# Altium schematic sheet S bus (5.775 X 3.30 inches).schdoc: Módulo do processamento do Kit didático
size A4; Organization: PEA USP; Address1: Address1; Address2: Address2; Address3: Address3; Address4: Address4; DocumentNumber: 1; Revision: LMK, HMH; SheetNumber: 1; SheetTotal: 1; Author: Gustavo Soares Valentim; ProjectName: Módulo do processamento
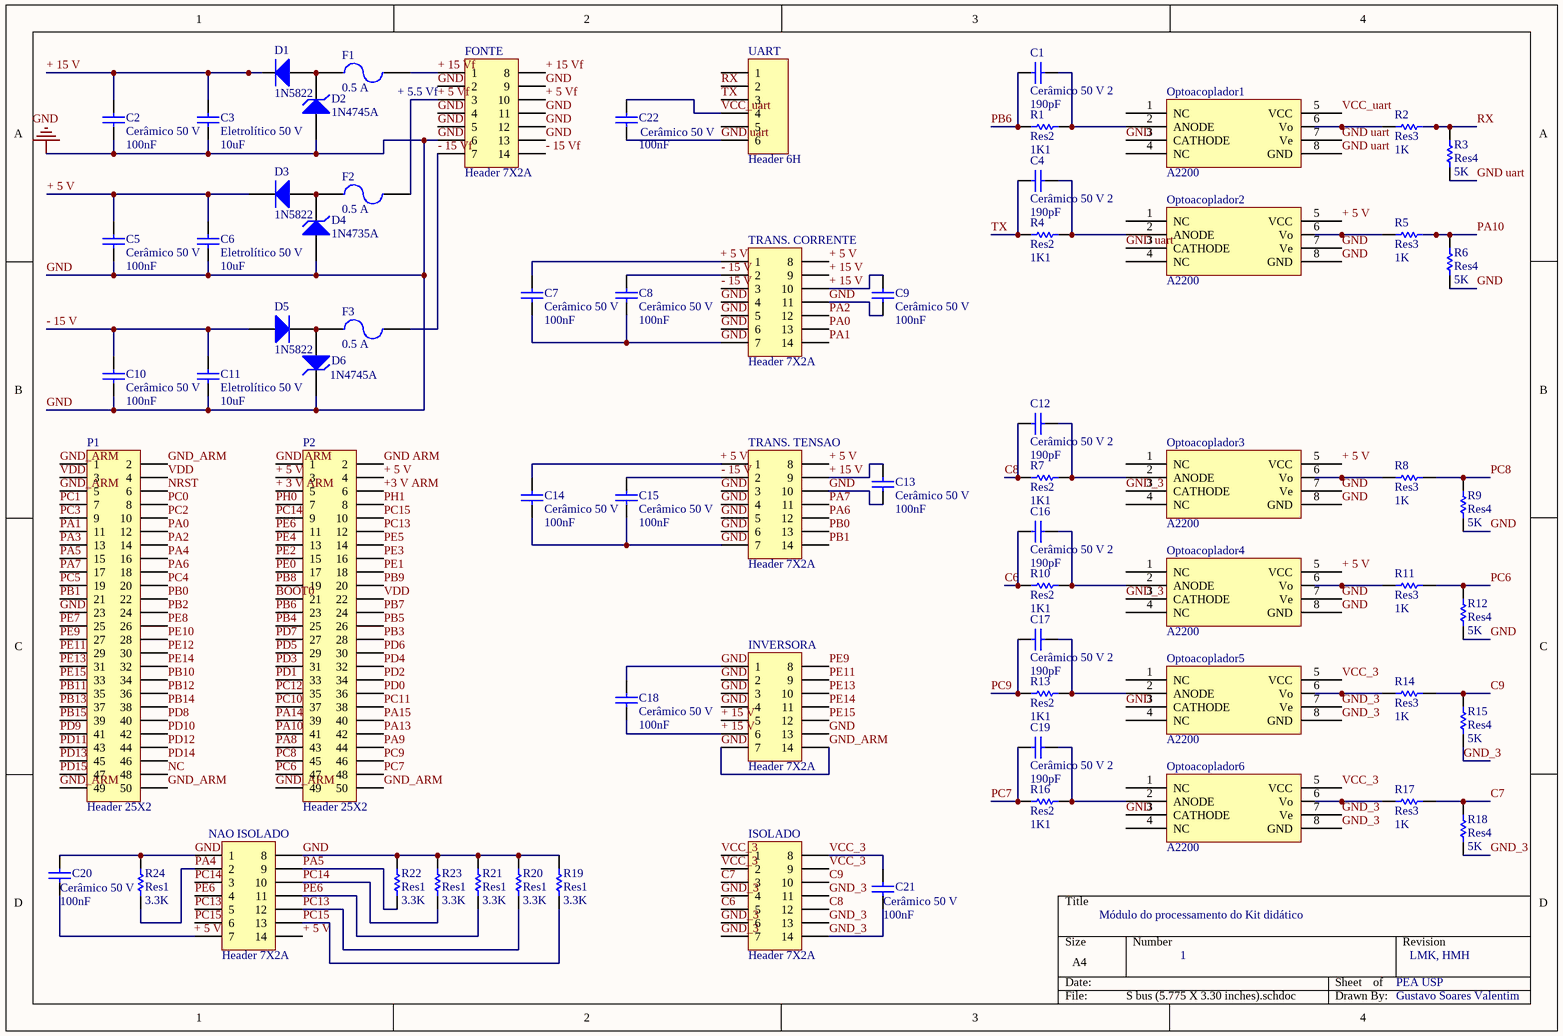
[diagram p0: S bus (5.775 X 3.30 inches).schdoc]

## Parts
C1  Cerâmico 50 V 2  value 190pF  [RAD-0.2]
C2  Cerâmico 50 V  value 100nF  [RAD-0.2]
C3  Eletrolítico 50 V  value 10uF  [RB5-10.5]
C4  Cerâmico 50 V 2  value 190pF  [RAD-0.2]
C5  Cerâmico 50 V  value 100nF  [RAD-0.2]
C6  Eletrolítico 50 V  value 10uF  [RB5-10.5]
C7  Cerâmico 50 V  value 100nF  [RAD-0.2]
C8  Cerâmico 50 V  value 100nF  [RAD-0.2]
C9  Cerâmico 50 V  value 100nF  [RAD-0.2]
C10  Cerâmico 50 V  value 100nF  [RAD-0.2]
C11  Eletrolítico 50 V  value 10uF  [RB5-10.5]
C12  Cerâmico 50 V 2  value 190pF  [RAD-0.2]
C13  Cerâmico 50 V  value 100nF  [RAD-0.2]
C14  Cerâmico 50 V  value 100nF  [RAD-0.2]
C15  Cerâmico 50 V  value 100nF  [RAD-0.2]
C16  Cerâmico 50 V 2  value 190pF  [RAD-0.2]
C17  Cerâmico 50 V 2  value 190pF  [RAD-0.2]
C18  Cerâmico 50 V  value 100nF  [RAD-0.2]
C19  Cerâmico 50 V 2  value 190pF  [RAD-0.2]
C20  Cerâmico 50 V  value 100nF  [RAD-0.2]
C21  Cerâmico 50 V  value 100nF  [RAD-0.2]
C22  Cerâmico 50 V  value 100nF  [RAD-0.2]
D1  1N5822  [AXIAL-0.4]
D2  1N4745A  [DIODE-0.4]
D3  1N5822  [AXIAL-0.4]
D4  1N4735A  [DIODE-0.4]
D5  1N5822  [AXIAL-0.4]
D6  1N4745A  [DIODE-0.4]
F1  0.5 A  [Fusivel]
F2  0.5 A  [Fusivel]
F3  0.5 A  [Fusivel]
FONTE  Header 7X2A  [HDR2X7_CEN]
INVERSORA  Header 7X2A  [HDR2X7_CEN]
ISOLADO  Header 7X2A  [HDR2X7_CEN]
NAO_ISOLADO  Header 7X2A  [HDR2X7_CEN]
Optoacoplador1  A2200  [DIP8]
Optoacoplador2  A2200  [DIP8]
Optoacoplador3  A2200  [DIP8]
Optoacoplador4  A2200  [DIP8]
Optoacoplador5  A2200  [DIP8]
Optoacoplador6  A2200  [DIP8]
P1  Header 25X2  [HDR2X25]
P2  Header 25X2  [HDR2X25]
R1  Res2  value 1K1  [AXIAL-0.3]
R2  Res3  value 1K  [AXIAL-0.3]
R3  Res4  value 5K  [AXIAL-0.3]
R4  Res2  value 1K1  [AXIAL-0.3]
R5  Res3  value 1K  [AXIAL-0.3]
R6  Res4  value 5K  [AXIAL-0.3]
R7  Res2  value 1K1  [AXIAL-0.3]
R8  Res3  value 1K  [AXIAL-0.3]
R9  Res4  value 5K  [AXIAL-0.3]
R10  Res2  value 1K1  [AXIAL-0.3]
R11  Res3  value 1K  [AXIAL-0.3]
R12  Res4  value 5K  [AXIAL-0.3]
R13  Res2  value 1K1  [AXIAL-0.3]
R14  Res3  value 1K  [AXIAL-0.3]
R15  Res4  value 5K  [AXIAL-0.3]
R16  Res2  value 1K1  [AXIAL-0.3]
R17  Res3  value 1K  [AXIAL-0.3]
R18  Res4  value 5K  [AXIAL-0.3]
R19  Res1  value 3.3K  [AXIAL-0.3]
R20  Res1  value 3.3K  [AXIAL-0.3]
R21  Res1  value 3.3K  [AXIAL-0.3]
R22  Res1  value 3.3K  [AXIAL-0.3]
R23  Res1  value 3.3K  [AXIAL-0.3]
R24  Res1  value 3.3K  [AXIAL-0.3]
TRANS._CORRENTE  Header 7X2A  [HDR2X7_CEN]
TRANS._TENSAO  Header 7X2A  [HDR2X7_CEN]
UART  Header 6H  [HDR1X6]

## Nets
GND: C2.1 C3.1 C5.1 C6.1 C7.1 C8.1 C9.1 C10.1 C11.1 C13.1 C14.1 C15.1 C18.2 C20.2 D2.1(A) D4.1(A) D6.2(K) FONTE.2 FONTE.4 FONTE.5 FONTE.6 FONTE.9 FONTE.11 FONTE.12 FONTE.13 INVERSORA.1 INVERSORA.2 INVERSORA.3 INVERSORA.4 INVERSORA.7 INVERSORA.13 INVERSORA.14 NAO_ISOLADO.1 NAO_ISOLADO.8 Optoacoplador1.3(CATHODE) Optoacoplador2.7(Ve) Optoacoplador2.8(GND) Optoacoplador3.7(Ve) Optoacoplador3.8(GND) Optoacoplador4.7(Ve) Optoacoplador4.8(GND) Optoacoplador5.3(CATHODE) Optoacoplador6.3(CATHODE) P1.1 P1.2 P1.5 P1.23 P1.49 P1.50 P2.49 P2.50 R6.1 R9.1 R12.1 R19.2 R20.2 R21.2 R22.2 R23.2 R24.2 TRANS._CORRENTE.4 TRANS._CORRENTE.5 TRANS._CORRENTE.6 TRANS._CORRENTE.7 TRANS._CORRENTE.11 TRANS._TENSAO.3 TRANS._TENSAO.4 TRANS._TENSAO.5 TRANS._TENSAO.6 TRANS._TENSAO.7 TRANS._TENSAO.10  [also labelled GND_ARM]
+3 V ARM: P2.6
+ 3 V ARM: P2.5
+ 5 V: C5.2 C6.2 C7.2 C14.2 C20.1 D3.2(K) NAO_ISOLADO.7 NAO_ISOLADO.14 Optoacoplador2.5(VCC) Optoacoplador3.5(VCC) Optoacoplador4.5(VCC) P2.3 P2.4 TRANS._CORRENTE.1 TRANS._CORRENTE.8 TRANS._TENSAO.1 TRANS._TENSAO.8
+ 5 Vf: F2.2 FONTE.3 FONTE.10
+ 15 V: C2.2 C3.2 C9.2 C13.2 C18.1 D1.2(K) INVERSORA.5 INVERSORA.6 TRANS._CORRENTE.9 TRANS._CORRENTE.10 TRANS._TENSAO.9
+ 15 Vf: F1.2 FONTE.1 FONTE.8
- 15 V: C8.2 C10.2 C11.2 C15.2 D5.1(A) TRANS._CORRENTE.2 TRANS._CORRENTE.3 TRANS._TENSAO.2
- 15 Vf: F3.2 FONTE.7 FONTE.14
BOOT0: P2.21
C6: C16.2 ISOLADO.5 R10.1
C7: ISOLADO.3 R17.2 R18.2
C8: C12.2 ISOLADO.12 R7.1
C9: ISOLADO.10 R14.2 R15.2
GND ARM: P2.1 P2.2
GND uart: C22.1 Optoacoplador1.7(Ve) Optoacoplador1.8(GND) Optoacoplador2.3(CATHODE) R3.1 UART.6
GND_3: C21.1 ISOLADO.4 ISOLADO.6 ISOLADO.7 ISOLADO.11 ISOLADO.13 ISOLADO.14 Optoacoplador3.3(CATHODE) Optoacoplador4.3(CATHODE) Optoacoplador5.7(Ve) Optoacoplador5.8(GND) Optoacoplador6.7(Ve) Optoacoplador6.8(GND) R15.1 R18.1
NC: P1.48
NRST: P1.6
PA0: P1.12 TRANS._CORRENTE.13
PA1: P1.11 TRANS._CORRENTE.14
PA2: P1.14 TRANS._CORRENTE.12
PA3: P1.13
PA4: NAO_ISOLADO.2 P1.16 R24.1
PA5: NAO_ISOLADO.9 P1.15 R22.1
PA6: P1.18 TRANS._TENSAO.12
PA7: P1.17 TRANS._TENSAO.11
PA8: P2.43
PA9: P2.44
PA10: P2.41 R5.2 R6.2
PA13: P2.42
PA14: P2.39
PA15: P2.40
PB0: P1.22 TRANS._TENSAO.13
PB1: P1.21 TRANS._TENSAO.14
PB2: P1.24
PB3: P2.28
PB4: P2.25
PB5: P2.26
PB6: C1.2 P2.23 R1.1
PB7: P2.24
PB8: P2.19
PB9: P2.20
PB10: P1.34
PB11: P1.35
PB12: P1.36
PB13: P1.37
PB14: P1.38
PB15: P1.39
PC0: P1.8
PC1: P1.7
PC2: P1.10
PC3: P1.9
PC4: P1.20
PC5: P1.19
PC6: P2.47 R11.2 R12.2
PC7: C19.2 P2.48 R16.1
PC8: P2.45 R8.2 R9.2
PC9: C17.2 P2.46 R13.1
PC10: P2.37
PC11: P2.38
PC12: P2.35
PC13: NAO_ISOLADO.5 NAO_ISOLADO.12 P2.12 R20.1
PC14: NAO_ISOLADO.3 NAO_ISOLADO.10 P2.9 R23.1
PC15: NAO_ISOLADO.6 NAO_ISOLADO.13 P2.10 R19.1
PD0: P2.36
PD1: P2.33
PD2: P2.34
PD3: P2.31
PD4: P2.32
PD5: P2.29
PD6: P2.30
PD7: P2.27
PD8: P1.40
PD9: P1.41
PD10: P1.42
PD11: P1.43
PD12: P1.44
PD13: P1.45
PD14: P1.46
PD15: P1.47
PE0: P2.17
PE1: P2.18
PE2: P2.15
PE3: P2.16
PE4: P2.13
PE5: P2.14
PE6: NAO_ISOLADO.4 NAO_ISOLADO.11 P2.11 R21.1
PE7: P1.25
PE8: P1.26
PE9: INVERSORA.8 P1.27
PE10: P1.28
PE11: INVERSORA.9 P1.29
PE12: P1.30
PE13: INVERSORA.10 P1.31
PE14: INVERSORA.11 P1.32
PE15: INVERSORA.12 P1.33
PH0: P2.7
PH1: P2.8
RX: R2.2 R3.2 UART.2
TX: C4.2 R4.1 UART.3
VCC_3: C21.2 ISOLADO.1 ISOLADO.2 ISOLADO.8 ISOLADO.9 Optoacoplador5.5(VCC) Optoacoplador6.5(VCC)
VCC_uart: C22.2 Optoacoplador1.5(VCC) UART.4
VDD: P1.3 P1.4 P2.22
NetC1_1: C1.1 Optoacoplador1.2(ANODE) R1.2
NetC4_1: C4.1 Optoacoplador2.2(ANODE) R4.2
NetC12_1: C12.1 Optoacoplador3.2(ANODE) R7.2
NetC16_1: C16.1 Optoacoplador4.2(ANODE) R10.2
NetC17_1: C17.1 Optoacoplador5.2(ANODE) R13.2
NetC19_1: C19.1 Optoacoplador6.2(ANODE) R16.2
NetD1_1: D1.1(A) D2.2(K) F1.1
NetD3_1: D3.1(A) D4.2(K) F2.1
NetD5_2: D5.2(K) D6.1(A) F3.1
NetOptoacoplador1_6: Optoacoplador1.6(Vo) R2.1
NetOptoacoplador2_6: Optoacoplador2.6(Vo) R5.1
NetOptoacoplador3_6: Optoacoplador3.6(Vo) R8.1
NetOptoacoplador4_6: Optoacoplador4.6(Vo) R11.1
NetOptoacoplador5_6: Optoacoplador5.6(Vo) R14.1
NetOptoacoplador6_6: Optoacoplador6.6(Vo) R17.1

Not connected (* = marked no-connect by the designer): Optoacoplador1 1(NC) 4(NC); Optoacoplador2 1(NC) 4(NC); Optoacoplador3 1(NC) 4(NC); Optoacoplador4 1(NC) 4(NC); Optoacoplador5 1(NC) 4(NC); Optoacoplador6 1(NC) 4(NC); UART 1 5

## Notes on the sheet
- + 5.5 Vf

## Library data of the parts
C1-C22 = Cap: Capacitor; Published: 8-Jun-2000; LatestRevisionDate: 17-Jul-2002; LatestRevisionNote: Re-released for DXP Platform.; PackageReference: RAD-0.3; Publisher: Altium Limited; PackageDescription: Radial Cap, Thru-Hole; 2 Leads; 0.3 in Pin Spacing
D1 D3 D5 = Diode: Default Diode; Published: 8-Jun-2000; LatestRevisionDate: 17-Jul-2002; LatestRevisionNote: Re-released for DXP Platform.; PackageVersion: Sep-1996; PackageReference: SMC; Publisher: Altium Limited; PackageDescription: DO-214-AB/SMC; 2 C-Bend Leads; Body 7.9 x 5.9 mm, inc. leads (LxW); Code_JEDEC: DO-214-AB
D2 D4 D6 = D Zener: Zener Diode; Published: 8-Jun-2000; LatestRevisionDate: 17-Jul-2002; LatestRevisionNote: Re-released for DXP Platform.; PackageReference: DIODE-0.7; Publisher: Altium Limited; PackageDescription: Diode, Thru-Hole; 2 Leads; 0.7 in Pin Spacing
F1-F3 = Fuse 2: Fuse; Published: 8-Jun-2000; LatestRevisionDate: 17-Jul-2002; LatestRevisionNote: Re-released for DXP Platform.; PackageReference: PIN-W2/E2.8; Publisher: Altium Limited; PackageDescription: Thru-Hole; 2 Leads
FONTE INVERSORA ISOLADO NAO_ISOLADO TRANS._CORRENTE TRANS._TENSAO = Header 7X2A: Header, 7-Pin, Dual row; LatestRevisionDate: 17-Jul-2002; LatestRevisionNote: Re-released for DXP Platform.; Publisher: Altium Limited
Optoacoplador1-Optoacoplador6 = Optoacoplador
P1 P2 = Header 25X2: Header, 25-Pin, Dual row; LatestRevisionDate: 17-Jul-2002; LatestRevisionNote: Re-released for DXP Platform.; Publisher: Altium Limited
R1-R24 = Res1: Resistor; Published: 8-Jun-2000; LatestRevisionDate: 17-Jul-2002; LatestRevisionNote: Re-released for DXP Platform.; PackageReference: AXIAL-0.3; Publisher: Altium Limited; PackageDescription: Axial Device, Thru-Hole; 2 Leads; 0.3 in Pin Spacing
UART = Header 6H: Header, 6-Pin, Right Angle; LatestRevisionDate: 17-Jul-2002; LatestRevisionNote: Re-released for DXP Platform.; Publisher: Altium Limited